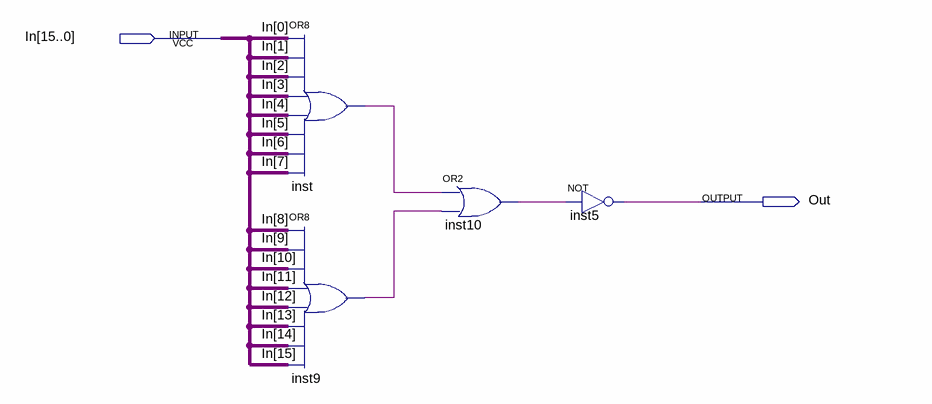
[diagram p0: schematic sheet]
// Quartus schematic nor16bb.bdf as structural Verilog: 4 symbols, 2 pins
module nor16bb (
  input  [15:0] In,
  output Out
);

  wire inst9_out, inst10_out, inst_out;

  or inst (inst_out, In[0], In[1], In[2], In[3], In[4], In[5], In[6], In[7]);
  or inst9 (inst9_out, In[8], In[9], In[10], In[11], In[12], In[13], In[14], In[15]);
  or inst10 (inst10_out, inst_out, inst9_out);
  not inst5 (Out, inst10_out);
endmodule
